# EAGLE design TPT02rrrrr (EAGLE 7.7.0)
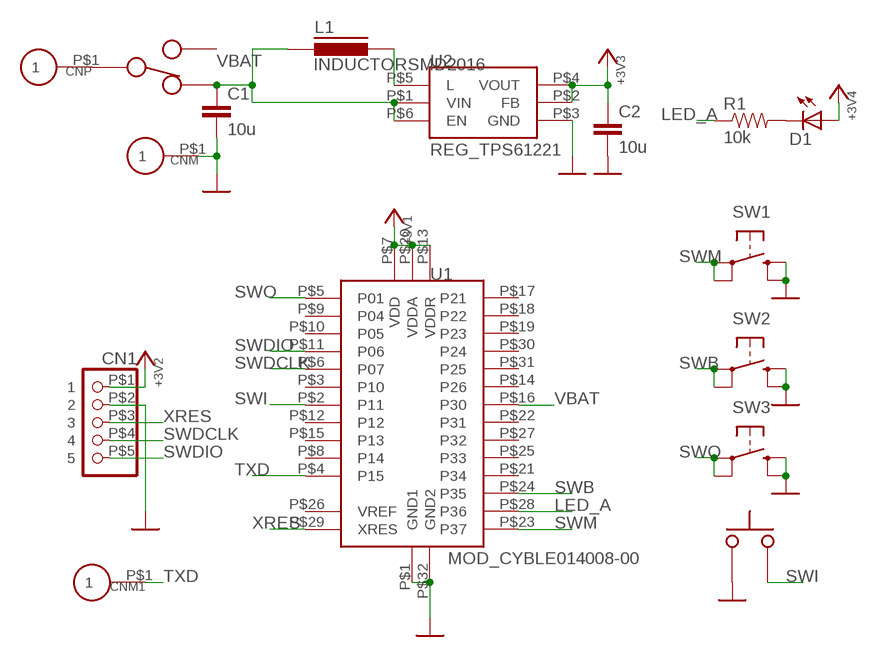
[diagram p0: schematic, sheet 1]

## Parts
C1  10u  CAP0603  [0603]
C2  10u  CAP0603  [0603]
CN1  CON_PINHD-1X550MIL  [1X5_50MIL]
CNM  CON_P01SMD1MM  [PAD_SMD1MM]
CNM1  CON_P01SMD1MM  [PAD_SMD1MM]
CNP  CON_P01SMD1MM  [PAD_SMD1MM]
D1  LED0603  [SPARKFUN_LED-0603]
L1  INDUCTORSMD2016  [2016]
R1  10k  RES0603  [0603]
SW1  SW_TACTEVQP2  [SW_EVQP2]
SW2  SW_TACTEVQPLNA08NOGND  [SW_EVQPLBA08_NOGND]
SW3  SW_TACTEVQPLNA08NOGND  [SW_EVQPLBA08_NOGND]
SW4  SW_SLIDECUS12B  [SW_CUS-12B]
SW5  SW_TACT2PB3U3000  [SW_B3U-3000P]
U1  MOD_CYBLE014008-00  [MOD_CYBLE014008-00]
U2  REG_TPS61221  [SC70-6]

## Nets
+3V3: C2.1 CN1.P$1 D1.A U1.P$7(VDD) U1.P$13(VDDR) U1.P$20(VDDA) U2.P$2(FB) U2.P$4(VOUT) ; supply symbol labelled POW_+3V3
GND: C1.2 C2.2 CN1.P$2 CNM.P$1 SW1.PB1(S) SW1.PB2(S1) SW2.B1(S) SW2.B2(S1) SW3.B1(S) SW3.B2(S1) SW5.P$2 U1.P$1(GND1) U1.P$32(GND2) U2.P$3(GND) ; supply symbol labelled POW_GND
LED_A: R1.1 U1.P$28(P36)
N$2: L1.P$2 U2.P$5(L)
N$7: D1.C R1.2
N$8: CNP.P$1 SW4.P$2
SWB: SW2.A1(P) SW2.A2(P1) U1.P$24(P35)
SWDCLK: CN1.P$4 U1.P$6(P07)
SWDIO: CN1.P$5 U1.P$11(P06)
SWI: SW5.P$1 U1.P$2(P11)
SWM: SW1.PA1(P) SW1.PA2(P1) U1.P$23(P37)
SWO: SW3.A1(P) SW3.A2(P1) U1.P$5(P01)
TXD: CNM1.P$1 U1.P$4(P15)
VBAT: C1.1 L1.P$1 SW4.P$1 U1.P$16(P30) U2.P$1(VIN) U2.P$6(EN)
XRES: CN1.P$3 U1.P$29(XRES)
Unconnected: U1.P$3(P10) U1.P$8(P14) U1.P$9(P04) U1.P$10(P05) U1.P$12(P12) U1.P$14(P26) U1.P$15(P13) U1.P$17(P21) U1.P$18(P22) U1.P$19(P23) U1.P$21(P34) U1.P$22(P31) U1.P$25(P33) U1.P$26(VREF) U1.P$27(P32) U1.P$30(P24) U1.P$31(P25)

## Power pins joined to a net without a drawn wire
P$3: SW4.P$3

## Library data of the parts
C1 C2 = akita:CAP: Capacitor Standard 0603 ceramic capacitor, and 0.1" leaded capacitor.
CN1 = akita:CON_PINHD-1X5: PIN HEADER
CNM CNM1 CNP = akita:CON_P01
D1 = akita:LED: LEDs Standard schematic elements and footprints for 5mm, 3mm, 1206, and 0603 sized LEDs. 5mm - Spark Fun Electronics SKU : COM-00529 (and others)
L1 = akita:INDUCTOR: Inductor
R1 = akita:RES: Resistor Basic schematic elements and footprints for 0603, 1206, and PTH resistors.
SW1-SW3 = akita:SW_TACT: OMRON SWITCH
SW4 = akita:SW_SLIDE
SW5 = akita:SW_TACT2P: OMRON SWITCH
U1 = akita:MOD_CYBLE014008-00: Cypress CYBLE014008-000
U2 = akita:REG_TPS61221: TI's TPS61220/1/2, boost DC/DC

## Board
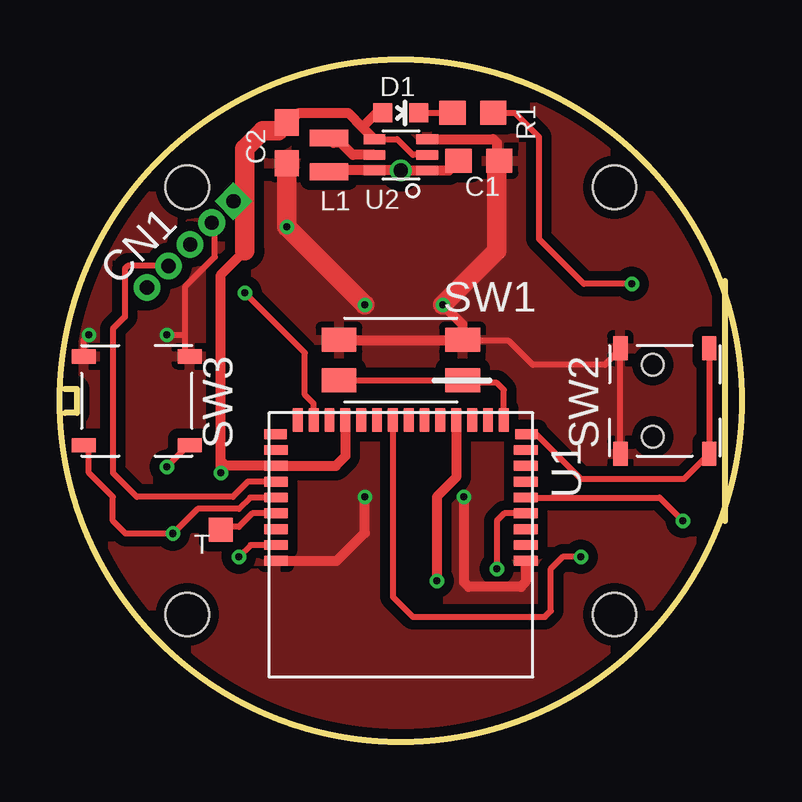
[diagram p1: board, top side]
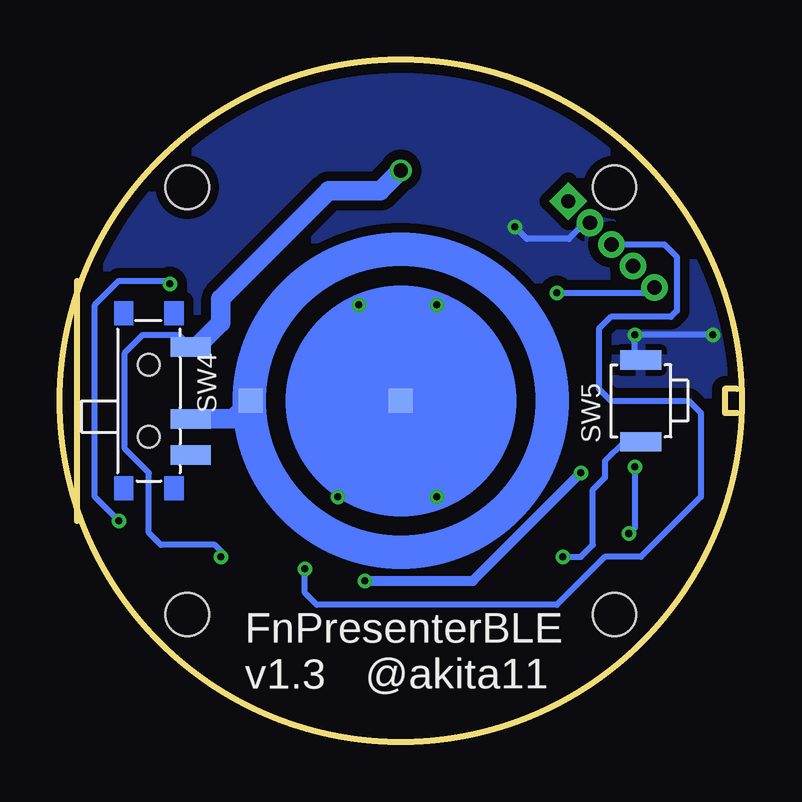
[diagram p2: board, bottom side, seen from below]

Size 28.4 x 28.4 mm. Coordinates in mm from the lower left corner, seen from the top.
Outline: 27.7,19.2 27.7,9.2
Outline: 0.2,14.7 0.7,14.7 0.7,13.7 0.2,13.7
Outline: circle at 14.2,14.2 radius 14.2
Copper layers (1*16): Top 0.035mm / dielectric 1.5mm / Bottom 0.035mm
Design rules "SeeedStudio_2layer_DRU_no_angle_20140221_Drill03mm": minimum track width 6mil, minimum drill 0.3mm, track to track 6mil, track to pad 6mil, pad to pad 6mil, via to via 6mil, smd to smd 0mil, copper to edge 10mil, drill to drill 10mil, minimum pad ring 10mil, minimum via ring 6mil, stop-mask expansion 2mil, vias tented up to drill 100mil, thermal gap 10mil
Holes 1.8 mm at 5.3,5.3 23.1,5.3 23.1,23.1 5.3,23.1

### Footprints (pad centres in the part's own frame; a part is rotated, then mirrored left to right if it is on the bottom)
0603 = smd 1.1 x 1: 1 -0.85,0; 2 0.85,0
1X5_50MIL = drill 0.6 square: P$1 0,2.54 | drill 0.6: P$2 0,1.27; P$3 0,0; P$4 0,-1.27; P$5 0,-2.54
PAD_SMD1MM = smd 1 x 1: P$1 0,0
SPARKFUN_LED-0603 = smd 0.8 x 0.8: A 0,-0.75; C 0,0.75
2016 = smd 0.7 x 1.6: P$1 -0.7,0; P$2 0.7,0
SW_EVQP2 = smd 1.45 x 1: PA1 -2.575,0.85; PA2 2.575,0.85; PB1 -2.575,-0.85; PB2 2.575,-0.85
SW_EVQPLBA08_NOGND = smd 0.6 x 1: A1 -1.85,2.2; A2 -1.85,-2.2; B1 1.85,2.2; B2 1.85,-2.2
SW_CUS-12B = smd 0.813 x 1.676: P$1 -2.25,1.75; P$2 0.75,1.75; P$3 2.25,1.75 | hole 0.9: -1.5,0; 1.5,0
SW_B3U-3000P = smd 0.8 x 1.7: P$1 1.7,0; P$2 -1.7,0
MOD_CYBLE014008-00 = smd 0.99 x 0.41: P$1 5.205,0.67; P$2 5.205,0.01; P$3 5.205,-0.65; P$4 5.205,-1.31; P$5 5.205,-1.97; P$6 5.205,-2.63; P$7 5.205,-3.29; P$8 5.205,-3.95; P$25 -5.205,-3.95; P$26 -5.205,-3.29; P$27 -5.205,-2.63; P$28 -5.205,-1.97; P$29 -5.205,-1.31; P$30 -5.205,-0.65; P$31 -5.205,0.01; P$32 -5.205,0.67 | smd 0.94 x 0.41: P$9 5.23,-4.61; P$24 -5.23,-4.61 | smd 0.41 x 0.99: P$10 4.29,-5.205; P$11 3.63,-5.205; P$12 2.97,-5.205; P$13 2.31,-5.205; P$14 1.65,-5.205; P$15 0.99,-5.205; P$16 0.33,-5.205; P$17 -0.33,-5.205; P$18 -0.99,-5.205; P$19 -1.65,-5.205; P$20 -2.31,-5.205; P$21 -2.97,-5.205; P$22 -3.63,-5.205; P$23 -4.29,-5.205
SC70-6 = smd 0.4 x 0.9: P$1 -0.65,-1.1; P$2 0,-1.1; P$3 0.65,-1.1; P$4 0.65,1.1; P$5 0,1.1; P$6 -0.65,1.1

### Placement (x,y rotation side)
C1  17.45,24.2 0 top
C2  9.45,24.95 270 top
CN1  5.42,20.72 315 top
CNM  14.2,14.2 0 bottom
CNM1  6.7,8.82 0 top
CNP  20.45,14.2 0 bottom
D1  14.2,26.2 270 top
L1  11.2,24.45 90 top
R1  17.2,26.2 180 top
SW1  14.2,15.9 180 top
SW2  25.2,14.2 180 top
SW3  3.2,14.2 90 top
SW4  24.7,14.2 270 bottom
SW5  4.2,14.2 270 bottom
U1  14.2,8.2 180 top
U2  14.2,24.45 90 top

### Tracks (layer width: path | path; a pad name or v marks a point on that pad's centre or on a via)
+3V3  (via drill 0.3)
  Top 0.254: 7.7,22.07 7.66,22.07 CN1.P$1 7.7,22.04 7.7,20.45 | U2.P$2 14.7,24.45 14.05,25.1 U2.P$4
  Top 0.406: 7.7,20.45 6.7,19.45 6.7,11.7 | U1.P$20 16.51,11.01 15.7,10.2 v15.7,6.7 | v6.7,11.2 6.7,11.7 | 6.7,11.7 6.91,11.49 U1.P$7 11.49,11.49 11.89,11.89 U1.P$13 | C2.1 9.55,25.8 9.95,26.2 12,26.2 12.6,25.6 | 12.6,25.6 U2.P$4 | D1.A 13.2,26.2 12.6,25.6
  Top 0.813: 7.7,20.45 7.7,24.7 8.45,25.45 9.1,25.45 C2.1
  Bottom 0.406: v15.7,6.7 11.2,6.7 v6.7,11.2
GND  (via drill 0.3)
  Top 0.254: CN1.P$2 6.45,21.49 6.45,20.2 5.2,18.95 5.2,16.95 | 5.2,16.95 5.2,16.25 SW3.B2 | SW3.B1 1,16.75 v1.2,16.95 | v4.45,16.95 5.2,16.95 | SW1.PB1 16.82,16.7 18.7,16.7 19.7,15.7 22.7,15.7 23.35,16.35 SW2.B2 SW2.B1
  Top 0.406: v16.82,10.2 16.82,6.65 17.03,6.45 19.2,6.45 19.4,6.65 U1.P$32 | U1.P$1 11.53,7.53 12.7,8.7 v12.7,10.2 | U2.P$3 18.05,25.1 18.2,24.95 18.2,24.3 C1.2 | 16.82,16.7 11.67,16.7 SW1.PB2 | SW1.PB1 16.77,17.38 v15.95,18.2
  Top 0.813: C2.2 9.45,23.2 v9.45,21.45 v12.7,18.2 | 18.2,24.3 18.2,20.45 v15.95,18.2
  Bottom 0.254: CN1.P$2 6.53,21.62 7.2,20.95 8.95,20.95 v9.45,21.45 | v1.2,16.95 v4.45,16.95 4.45,15.9 SW5.P$2
  Bottom 0.406: v16.82,10.2 16.82,11.57 CNM.P$1 12.95,12.95 12.95,10.7 12.7,10.45 v12.7,10.2
  Bottom 0.813: v12.7,18.2 13.7,18.2 14.2,17.7 | 14.2,17.7 CNM.P$1 | v15.95,18.2 14.7,18.2 14.2,17.7
  pour Bottom (isolate 0.406): 0.2,28.2 27.2,28.2 27.2,0.2 0.2,0.2
  pour Top (isolate 0.406): 0.2,28.2 27.2,28.2 27.2,0.2 0.2,0.2
LED_A  (via drill 0.3)
  Top 0.254: 18.3,25.95 R1.1 18.95,26.2 19.95,25.2 19.95,20.95 21.82,19.07 v23.82,19.07 | U1.P$28 24.98,10.17 v25.95,9.2
  Bottom 0.254: v25.95,9.2 26.95,10.2 26.95,18.2 25.95,19.2 23.95,19.2 v23.82,19.07
N$2
  Top 0.406: U2.P$5 12.2,24.45 11.7,24.95 11.4,24.95 L1.P$2
N$7
  Top 0.254: D1.C R1.2
N$8
  Bottom 0.813: SW4.P$2 21.2,13.45 CNP.P$1
SWB
  Top 0.254: SW2.A2 SW2.A1 26,10.95 21.7,10.95 21.45,11.2 21.34,11.31 19.84,12.81 U1.P$24
SWDCLK
  Top 0.254: CN1.P$4 2.82,19.82 2.7,19.7 2.7,17.7 2.2,17.2 2.2,11.2 3.2,10.2 7.2,10.2 7.83,10.83 U1.P$6
SWDIO  (via drill 0.3)
  Top 0.254: v7.7,18.7 10.2,16.2 10.2,14.45 10.57,14.08 U1.P$11
  Bottom 0.254: v7.7,18.7 3.85,18.7 CN1.P$5
SWI  (via drill 0.3)
  Top 0.254: U1.P$2 7.94,8.19 v7.45,7.7
  Bottom 0.254: SW5.P$1 4.9,12.5 5.7,11.7 5.7,11 6.2,10.5 6.2,8.2 6.7,7.7 v7.45,7.7
SWM
  Top 0.254: SW1.PA2 SW1.PA1 16.88,14.95 18.2,14.95 18.49,14.66 U1.P$23
SWO  (via drill 0.3)
  Top 0.254: SW3.A1 1.2,12.15 1.2,11.2 2.2,10.2 2.2,9.2 2.73,8.67 v4.7,8.67 5.73,9.7 7.45,9.7 7.92,10.17 U1.P$5 | SW3.A2 5.35,12.35 v4.45,11.45
  Bottom 0.254: v4.45,11.45 4.45,8.92 v4.7,8.67
TXD
  Top 0.254: U1.P$4 8.01,9.51 7.45,8.95 6.82,8.95 CNM1.P$1
VBAT  (via drill 0.3, 0.6)
  Top 0.254: U1.P$16 13.87,6.03 14.7,5.2 20.2,5.2 20.45,5.45 20.45,7.2 20.95,7.7 v21.7,7.7
  Top 0.406: L1.P$1 11.25,23.8 U2.P$6 v14.2,23.8 U2.P$1 16.2,23.8 C1.1
  Bottom 0.254: v21.7,7.7 21.7,7.95 21.95,8.2 24.2,8.2 24.7,8.7 24.7,11.2 25.7,12.2 25.7,16.2 24.95,16.95 23.45,16.95 SW4.P$1
  Bottom 0.813: SW4.P$1 22.7,16.45 21.7,17.45 21.7,18.45 17.2,22.95 15.05,22.95 v14.2,23.8
XRES  (via drill 0.3)
  Top 0.254: U1.P$29 18.51,9.51 18.2,9.2 v18.2,7.2
  Bottom 0.254: CN1.P$3 3.22,20.72 2.7,20.2 2.7,17.95 2.95,17.7 5.45,17.7 5.95,17.2 5.95,14.7 5.45,14.2 2.2,14.2 1.7,13.7 1.7,10.2 4.2,7.7 5.7,7.7 7.7,5.7 17.7,5.7 18.2,6.2 v18.2,7.2
(copper drawn outside any net)
  shapes: Bottom circle x2

### Text on the board
tPlace: T
bPlace: @akita11 | FnPresenterBLE / v1.3
bNames: SW4
Document: t=0.7mm